# Altium schematic sheet FTDI.SchDoc
size A3; SheetNumber: 5; SheetTotal: 11
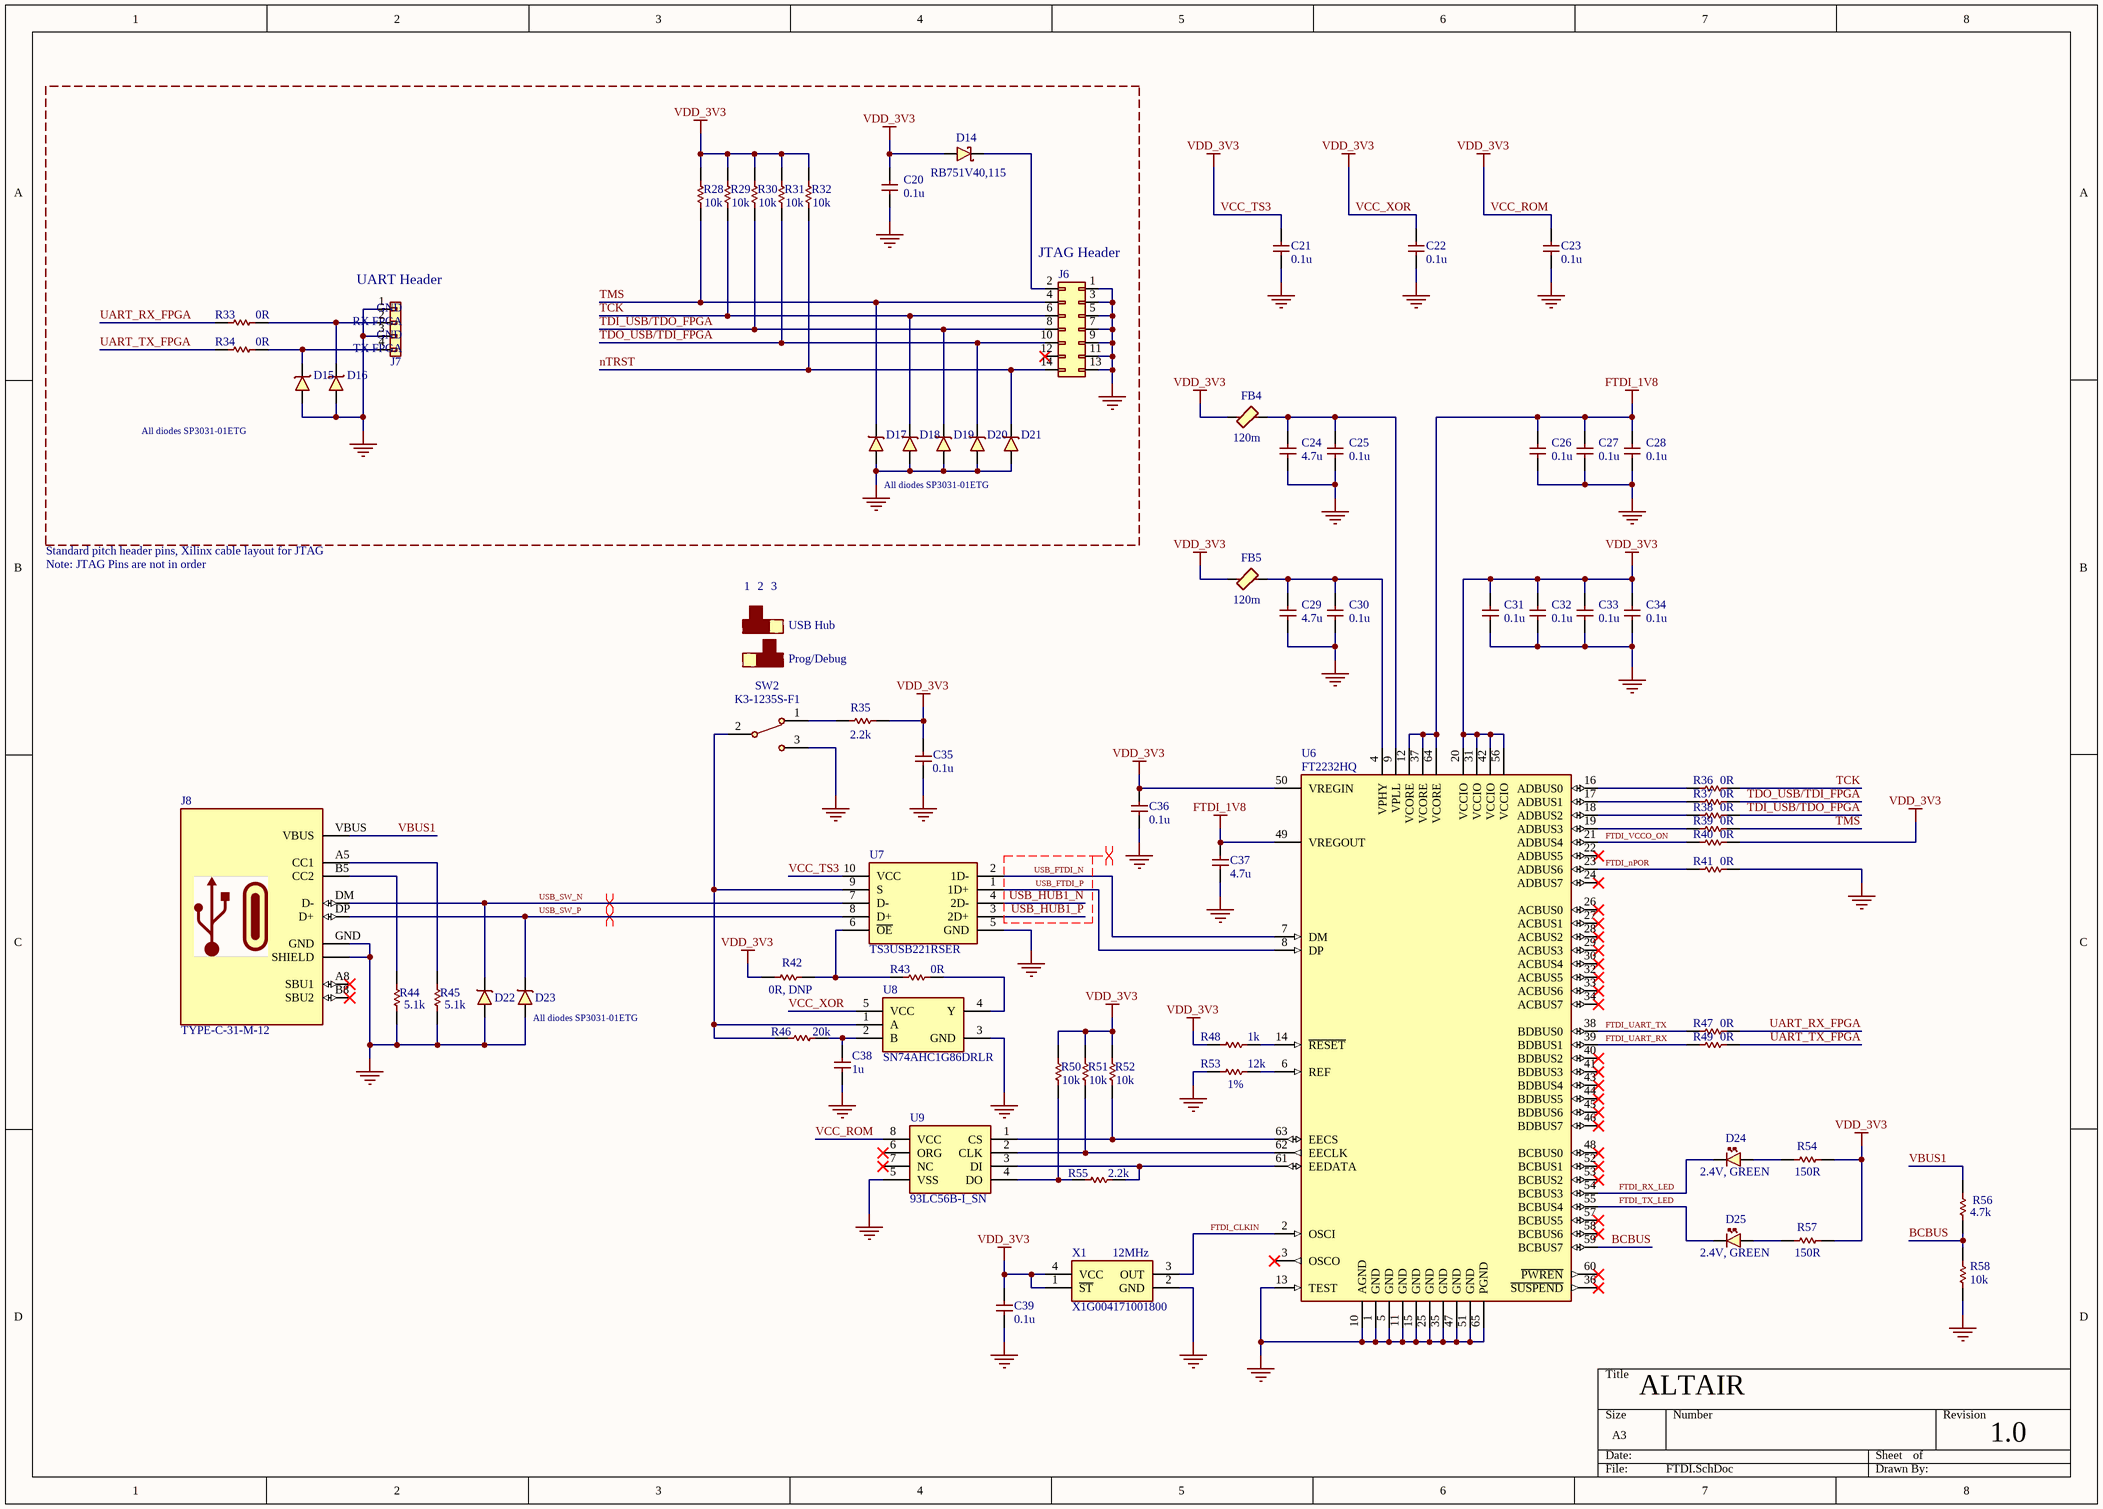
[diagram p0: FTDI.SchDoc]

## Parts
C20  0.1u  [CAP_0402]
C21  0.1u  [CAP_0402]
C22  0.1u  [CAP_0402]
C23  0.1u  [CAP_0402]
C24  4.7u  [CAP_0402]
C25  0.1u  [CAP_0402]
C26  0.1u  [CAP_0402]
C27  0.1u  [CAP_0402]
C28  0.1u  [CAP_0402]
C29  4.7u  [CAP_0402]
C30  0.1u  [CAP_0402]
C31  0.1u  [CAP_0402]
C32  0.1u  [CAP_0402]
C33  0.1u  [CAP_0402]
C34  0.1u  [CAP_0402]
C35  0.1u  [CAP_0402]
C36  0.1u  [CAP_0402]
C37  4.7u  [CAP_0402]
C38  1u  [CAP_0402]
C39  0.1u  [CAP_0402]
D14  RB751V40,115  [SOD2512X110N]
D15  SP3031-01ETG  [SP303101ETG]  (value not drawn)
D16  SP3031-01ETG  [SP303101ETG]  (value not drawn)
D17  SP3031-01ETG  [SP303101ETG]  (value not drawn)
D18  SP3031-01ETG  [SP303101ETG]  (value not drawn)
D19  SP3031-01ETG  [SP303101ETG]  (value not drawn)
D20  SP3031-01ETG  [SP303101ETG]  (value not drawn)
D21  SP3031-01ETG  [SP303101ETG]  (value not drawn)
D22  SP3031-01ETG  [SP303101ETG]  (value not drawn)
D23  SP3031-01ETG  [SP303101ETG]  (value not drawn)
D24  Note/Misc: 2.4V, GREEN  [LED_0805_GREEN]  (hidden comment: GREEN)
D25  Note/Misc: 2.4V, GREEN  [LED_0805_GREEN]  (hidden comment: GREEN)
FB4  120m  [FB_0201]
FB5  120m  [FB_0201]
J6  2x7Header  [67996114HLF]  (value not drawn)
J7  4xHeader  [HDRV4W95P0X254_1X4_1016X254X854P]  (value not drawn)
J8  TYPE-C-31-M-12  [HRO_TYPE-C-31-M-12]
R28  10k  [RES_0402]
R29  10k  [RES_0402]
R30  10k  [RES_0402]
R31  10k  [RES_0402]
R32  10k  [RES_0402]
R33  0R  [RES_0402]
R34  0R  [RES_0402]
R35  2.2k  [RES_0402]
R36  0R  [RES_0402]
R37  0R  [RES_0402]
R38  0R  [RES_0402]
R39  0R  [RES_0402]
R40  0R  [RES_0402]
R41  0R  [RES_0402]
R42  0R, DNP  [RES_0402]
R43  0R  [RES_0402]
R44  5.1k  [RES_0402]
R45  5.1k  [RES_0402]
R46  20k  [RES_0402]
R47  0R  [RES_0402]
R48  1k  [RES_0402]
R49  0R  [RES_0402]
R50  10k  [RES_0402]
R51  10k  [RES_0402]
R52  10k  [RES_0402]
R53  12k  Note/Misc: 1%  [RES_0402]
R54  150R  [RES_0402]
R55  2.2k  [RES_0402]
R56  4.7k  [RES_0402]
R57  150R  [RES_0402]
R58  10k  [RES_0402]
SW2  K3-1235S-F1  [K3-1235S-F1]
U6  FT2232HQ  [FP-FT2232HQ-Reel-IPC_C]
U7  TS3USB221RSER  [RSE(R-PUQFN-N10)]
U8  SN74AHC1G86DRLR  [SOTFL50P160X60-5N]
U9  93LC56B-I_SN  [SOIC127P600X175-8N]
X1  X1G004171001800  Note/Misc: 12MHz  [XTAL_2520]

## Nets
FTDI_1V8: C26.2 C27.2 C28.2 C37.2 U6.12(VCORE) U6.37(VCORE) U6.49(VREGOUT) U6.64(VCORE)
GND: C20.1 C21.1 C22.1 C23.1 C24.1 C25.1 C26.1 C27.1 C28.1 C29.1 C30.1 C31.1 C32.1 C33.1 C34.1 C35.1 C36.1 C37.1 C38.1 C39.1 D15.2(A) D16.2(A) D17.2(A) D18.2(A) D19.2(A) D20.2(A) D21.2(A) D22.2(A) D23.2(A) J6.1 J6.3 J6.5 J6.7 J6.9 J6.11 J6.13 J7.1 J7.3 J8.GND J8.SHLD(SHIELD) R41.2 R44.2 R45.2 R53.1 R58.2 SW2.3 U6.1(GND) U6.5(GND) U6.10(AGND) U6.11(GND) U6.13(TEST) U6.15(GND) U6.25(GND) U6.35(GND) U6.47(GND) U6.51(GND) U6.65(PGND) U7.5(GND) U8.3(GND) U9.5(VSS) X1.2(GND)
VCC_ROM: C20.2 C21.2 C22.2 C23.2 C31.2 C32.2 C33.2 C34.2 C35.2 C36.2 C39.2 D14.2 FB4.1 FB5.1 R28.1 R29.1 R30.1 R31.1 R32.1 R35.2 R40.2 R42.1 R48.1 R50.1 R51.1 R52.1 R54.2 R57.2 U6.20(VCCIO) U6.31(VCCIO) U6.42(VCCIO) U6.50(VREGIN) U6.56(VCCIO) U7.10(VCC) U8.5(VCC) U9.8(VCC) X1.1(~{ST}) X1.4(VCC)  [also labelled VCC_TS3, VCC_XOR, VDD_3V3]
BCBUS: R56.2 R58.1 U6.59(BCBUS7)
FTDI_CLKIN: U6.2(OSCI) X1.3(OUT)
FTDI_nPOR: R41.1 U6.23(ADBUS6)
FTDI_RX_LED: D24.K U6.54(BCBUS3)
FTDI_TX_LED: D25.K U6.55(BCBUS4)
FTDI_UART_RX: R49.1 U6.39(BDBUS1)
FTDI_UART_TX: R47.1 U6.38(BDBUS0)
FTDI_VCCO_ON: R40.1 U6.21(ADBUS4)
nTRST: D21.1(K) J6.14 R32.2
TCK: D18.1(K) J6.6 R29.2 R36.2
TDI_USB/TDO_FPGA: D19.1(K) J6.8 R30.2 R38.2
TDO_USB/TDI_FPGA: D20.1(K) J6.10 R31.2 R37.2
TMS: D17.1(K) J6.4 R28.2 R39.2
UART_RX_FPGA: R33.1 R47.2
UART_TX_FPGA: R34.1 R49.2
USB_FTDI_N: U6.7(DM) U7.2(1D-)
USB_FTDI_P: U6.8(DP) U7.1(1D+)
USB_HUB1_N: U7.4(2D-)
USB_HUB1_P: U7.3(2D+)
USB_SW_N: D22.1(K) J8.DM(D-) U7.7(D-)
USB_SW_P: D23.1(K) J8.DP(D+) U7.8(D+)
VBUS1: J8.VBUS R56.1
NetC24_2: C24.2 C25.2 FB4.2 U6.9(VPLL)
NetC29_2: C29.2 C30.2 FB5.2 U6.4(VPHY)
NetC38_2: C38.2 R46.2 U8.2(B)
NetD14_1: D14.1 J6.2
NetD15_1: D15.1(K) J7.4 R34.2
NetD16_1: D16.1(K) J7.2 R33.2
NetD24_A: D24.A R54.1
NetD25_A: D25.A R57.1
NetJ8_A5: J8.A5(CC1) R45.1
NetJ8_B5: J8.B5(CC2) R44.1
NetR35_1: R35.1 SW2.1
NetR36_1: R36.1 U6.16(ADBUS0)
NetR37_1: R37.1 U6.17(ADBUS1)
NetR38_1: R38.1 U6.18(ADBUS2)
NetR39_1: R39.1 U6.19(ADBUS3)
NetR42_2: R42.2 R43.1 U7.6(~{OE})
NetR43_2: R43.2 U8.4(Y)
NetR46_1: R46.1 SW2.2(C) U7.9(S) U8.1(A)
NetR48_2: R48.2 U6.14(~{RESET})
NetR50_2: R50.2 R55.2 U9.4(DO)
NetR51_2: R51.2 U6.62(EECLK) U9.2(CLK)
NetR52_2: R52.2 U6.63(EECS) U9.1(CS)
NetR53_2: R53.2 U6.6(REF)
NetR55_1: R55.1 U6.61(EEDATA) U9.3(DI)

Not connected (* = marked no-connect by the designer): J6 12*; J8 A8(SBU1)* B8(SBU2)*; U6 3(OSCO)* 22(ADBUS5)* 24(ADBUS7)* 26(ACBUS0)* 27(ACBUS1)* 28(ACBUS2)* 29(ACBUS3)* 30(ACBUS4)* 32(ACBUS5)* 33(ACBUS6)* 34(ACBUS7)* 36(~{SUSPEND})* 40(BDBUS2)* 41(BDBUS3)* 43(BDBUS4)* 44(BDBUS5)* 45(BDBUS6)* 46(BDBUS7)* 48(BCBUS0)* 52(BCBUS1)* 53(BCBUS2)* 57(BCBUS5)* 58(BCBUS6)* 60(~{PWREN})*; U9 6(ORG)* 7(NC)*

## Layout directives
differential pair: USB_FTDI_N, USB_FTDI_P, USB_HUB1_N, USB_HUB1_P, USB_SW_N, USB_SW_P

## Notes on the sheet
- (near J7) UART Header
- (near J7) GND
- (near J6) JTAG Header
- (near J7) RX FPGA
- (near J7) TX FPGA
- All diodes SP3031-01ETG
- Note: JTAG Pins are not in order
- Standard pitch header pins, Xilinx cable layout for JTAG
- 1
- 2
- 3
- USB Hub
- Prog/Debug
- (near D23) All diodes SP3031-01ETG
- ALTAIR
- 1.0

## Library data of the parts
C20-C23 C25-C28 C30-C36 C39 = CAP_0402: Capacitor SMD 0402; Part No: CL05B104KO5NNNC; Note/Misc: 16V, 0402; LCSC: *; JLCPCB Part #: C338112; Footprint JLCPCB: 0402
C24 C29 C37 = CAP_0402: Capacitor SMD 0402; Part No: HGC0402R5475M250NTEJ; LCSC: *; JLCPCB Part #: C22367824; Footprint JLCPCB: 0402
C38 = CAP_0402: Capacitor SMD 0402; Part No: CL05A105KP5NNNC; Note/Misc: 10V; LCSC: *; JLCPCB Part #: C14445; Footprint JLCPCB: 0402
D14 = RB751V40,115: Schottky Diode; LCSC: *; Note/Misc: *; Part No: RB751V40,115; JLCPCB Part #: C553814; Footprint JLCPCB: SOD-323
D15-D23 = SP3031-01ETG: TVS Diode (Uni-directional); Footprint JLCPCB: SOD-882; JLCPCB Part #: C207283; LCSC: *; Note/Misc: *; Part No: SP3031-01ETG
D24 D25 = LED_0805_GREEN: LED 0805 GREEN SMD; Part No: 17-21SYGC/S530-E2/TR8; LCSC: *; Footprint JLCPCB: 0805; JLCPCB Part #: C2986046
FB4 FB5 = FB_0201: Ferrite Bead SMD 0201; Part No: MPZ0603S121HT000; LCSC: *; Note/Misc: *; JLCPCB Part #: C695597; Footprint JLCPCB: 0201
J6 = 2x7Header: Standard 2x7 pin 2.54mm pitch connector; Part No: X6521WV-2x07H-C60D30; Footprint JLCPCB: Plugin,P=2.54mm; JLCPCB Part #: C706897
J7 = 4xHeader: Standard 4 pin 2.54mm pitch connector; Part No: X6511WV-04H-C60D30; Footprint JLCPCB: Plugin,P=2.54mm; JLCPCB Part #: C706876
J8 = TYPE-C-31-M-12: USB2.0, Type C, Top mount, CH 1.68mm, Dual Row SMT; LCSC: *; Note/Misc: *; Part No: TYPE-C-31-M-12; JLCPCB Part #: C165948; Footprint JLCPCB: SMD
R28-R32 R50-R52 R58 = RES_0402: Resistor SMD 0402; Part No: RC0402JR-0710KL; LCSC: *; JLCPCB Part #: C60489; Footprint JLCPCB: 0402
R33 R34 R36-R43 R47 R49 = RES_0402: Resistor SMD 0402; Part No: RC0402JR-070RL; LCSC: *; JLCPCB Part #: C60485; Footprint JLCPCB: 0402
  R42: Note/Misc: DNP
R35 R55 = RES_0402: Resistor SMD 0402; Part No: RC0402JR-072K2L; LCSC: *; JLCPCB Part #: C163447; Footprint JLCPCB: 0402
R44 R45 = RES_0402: Resistor SMD 0402; Part No: RC0402JR-075K1L; LCSC: *; JLCPCB Part #: C105873; Footprint JLCPCB: 0402
R46 = RES_0402: Resistor SMD 0402; Part No: RC0402FR-0720KL; LCSC: *; JLCPCB Part #: C93942; Footprint JLCPCB: 0402
R48 = RES_0402: Resistor SMD 0402; Part No: RC0402JR-071KL; LCSC: *; JLCPCB Part #: C105637; Footprint JLCPCB: 0402
R53 = RES_0402: Resistor SMD 0402; Part No: RC0402FR-0712KL; LCSC: *; JLCPCB Part #: C114760; Footprint JLCPCB: 0402
R54 R57 = RES_0402: Resistor SMD 0402; Part No: RC0402FR-07150RL; Note/Misc: 1%; LCSC: *; JLCPCB Part #: C138054; Footprint JLCPCB: 0402
R56 = RES_0402: Resistor SMD 0402; Part No: RC0402JR-074K7L; LCSC: *; JLCPCB Part #: C105870; Footprint JLCPCB: 0402
SW2 = K3-1235S-F1: Slide Switch SMD; LCSC: *; Note/Misc: *; Part No: K3-1235S-F1; JLCPCB Part #: C92660; Footprint JLCPCB: SMD
U6 = FT2232HQ-Reel: Dual High Speed USB To Multipurpose UART/FIFO IC, 64-pin LQFP, Tape and Reel; Footprint JLCPCB: QFN-64-EP(9x9); JLCPCB Part #: C193662; Part No: FT2232HQ
U7 = TS3USB221RSER: Diff Pair MUX/DEMUX; Footprint JLCPCB: UQFN-10(1.5x2); JLCPCB Part #: C130085; Part No: TS3USB221RSER
U8 = SN74AHC1G86DRLR: XOR Gate, 2 inputs 1 output; LCSC: *; Note/Misc: *; Part No: SN74AHC1G86DRLR; JLCPCB Part #: C2682053; Footprint JLCPCB: SOT-553-5
U9 = 93LC56B-I_SN: Integrated Circuit; Footprint JLCPCB: SOIC-8; JLCPCB Part #: C183620; Part No: 93LC56B-I_SN
X1 = X1G004171001800: Programmable Oscillator 12MHz; JLCPCB Part #: C255991; LCSC: *; Footprint JLCPCB: SMD2520-4P; Part No: X1G0041710018